# Altium schematic sheet L-Stick_sheet4_leds.SchDoc: L-Stick - LED Lights
size A4; DocumentNumber: 4; Revision: 1.0.0; SheetNumber: 4; SheetTotal: 5; DrawnBy: SU; DocumentSize: A4; PCAName: L-Stick
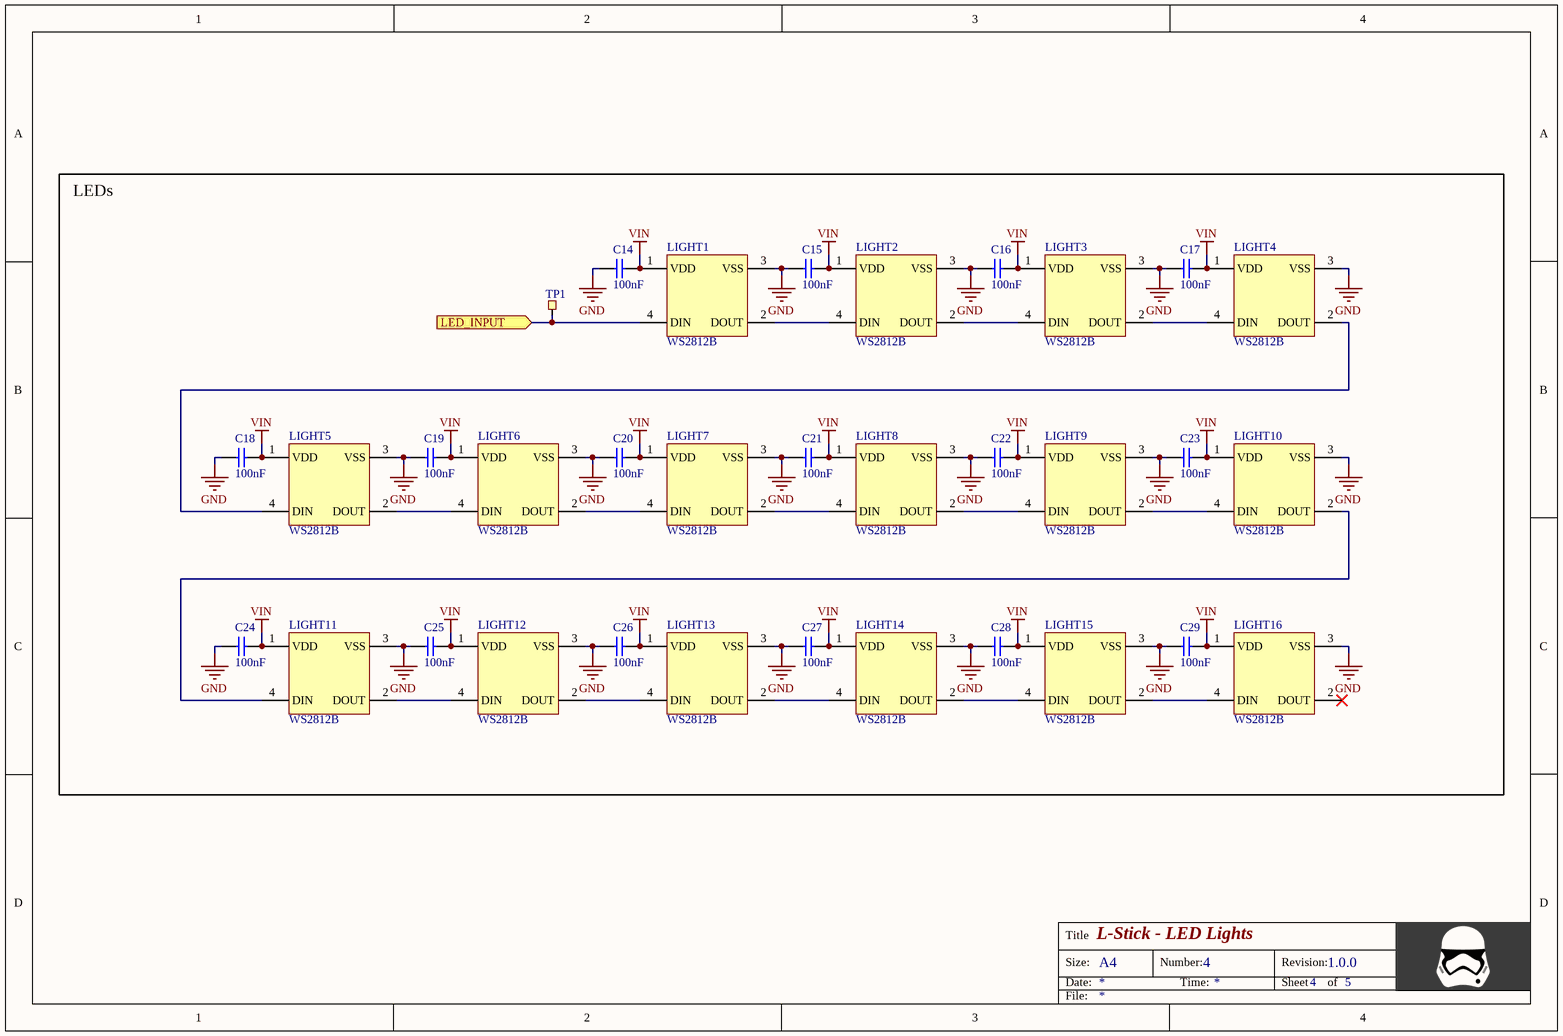
[diagram p0: L-Stick_sheet4_leds.SchDoc]

## Parts
C14  100nF  [0402C]
C15  100nF  [0402C]
C16  100nF  [0402C]
C17  100nF  [0402C]
C18  100nF  [0402C]
C19  100nF  [0402C]
C20  100nF  [0402C]
C21  100nF  [0402C]
C22  100nF  [0402C]
C23  100nF  [0402C]
C24  100nF  [0402C]
C25  100nF  [0402C]
C26  100nF  [0402C]
C27  100nF  [0402C]
C28  100nF  [0402C]
C29  100nF  [0402C]
LIGHT1  WS2812B  [WS2812B]
LIGHT2  WS2812B  [WS2812B]
LIGHT3  WS2812B  [WS2812B]
LIGHT4  WS2812B  [WS2812B]
LIGHT5  WS2812B  [WS2812B]
LIGHT6  WS2812B  [WS2812B]
LIGHT7  WS2812B  [WS2812B]
LIGHT8  WS2812B  [WS2812B]
LIGHT9  WS2812B  [WS2812B]
LIGHT10  WS2812B  [WS2812B]
LIGHT11  WS2812B  [WS2812B]
LIGHT12  WS2812B  [WS2812B]
LIGHT13  WS2812B  [WS2812B]
LIGHT14  WS2812B  [WS2812B]
LIGHT15  WS2812B  [WS2812B]
LIGHT16  WS2812B  [WS2812B]
TP1  Ø1.5mm,SMD  [TP_SMD]  (value not drawn)  (no BOM)

## Blocks framed on the sheet
LEDs: C14-C29 LIGHT1-LIGHT16 TP1

## Ports
LED_INPUT (in)

## Nets
GND: C14.1 C15.1 C16.1 C17.1 C18.1 C19.1 C20.1 C21.1 C22.1 C23.1 C24.1 C25.1 C26.1 C27.1 C28.1 C29.1 LIGHT1.3(VSS) LIGHT2.3(VSS) LIGHT3.3(VSS) LIGHT4.3(VSS) LIGHT5.3(VSS) LIGHT6.3(VSS) LIGHT7.3(VSS) LIGHT8.3(VSS) LIGHT9.3(VSS) LIGHT10.3(VSS) LIGHT11.3(VSS) LIGHT12.3(VSS) LIGHT13.3(VSS) LIGHT14.3(VSS) LIGHT15.3(VSS) LIGHT16.3(VSS)
VIN: C14.2 C15.2 C16.2 C17.2 C18.2 C19.2 C20.2 C21.2 C22.2 C23.2 C24.2 C25.2 C26.2 C27.2 C28.2 C29.2 LIGHT1.1(VDD) LIGHT2.1(VDD) LIGHT3.1(VDD) LIGHT4.1(VDD) LIGHT5.1(VDD) LIGHT6.1(VDD) LIGHT7.1(VDD) LIGHT8.1(VDD) LIGHT9.1(VDD) LIGHT10.1(VDD) LIGHT11.1(VDD) LIGHT12.1(VDD) LIGHT13.1(VDD) LIGHT14.1(VDD) LIGHT15.1(VDD) LIGHT16.1(VDD)
LED_INPUT: LIGHT1.4(DIN) TP1.1 ; port LED_INPUT
NetLIGHT1_2: LIGHT1.2(DOUT) LIGHT2.4(DIN)
NetLIGHT2_2: LIGHT2.2(DOUT) LIGHT3.4(DIN)
NetLIGHT3_2: LIGHT3.2(DOUT) LIGHT4.4(DIN)
NetLIGHT4_2: LIGHT4.2(DOUT) LIGHT5.4(DIN)
NetLIGHT5_2: LIGHT5.2(DOUT) LIGHT6.4(DIN)
NetLIGHT6_2: LIGHT6.2(DOUT) LIGHT7.4(DIN)
NetLIGHT7_2: LIGHT7.2(DOUT) LIGHT8.4(DIN)
NetLIGHT8_2: LIGHT8.2(DOUT) LIGHT9.4(DIN)
NetLIGHT9_2: LIGHT9.2(DOUT) LIGHT10.4(DIN)
NetLIGHT10_2: LIGHT10.2(DOUT) LIGHT11.4(DIN)
NetLIGHT11_2: LIGHT11.2(DOUT) LIGHT12.4(DIN)
NetLIGHT12_2: LIGHT12.2(DOUT) LIGHT13.4(DIN)
NetLIGHT13_2: LIGHT13.2(DOUT) LIGHT14.4(DIN)
NetLIGHT14_2: LIGHT14.2(DOUT) LIGHT15.4(DIN)
NetLIGHT15_2: LIGHT15.2(DOUT) LIGHT16.4(DIN)

Not connected (* = marked no-connect by the designer): LIGHT16 2(DOUT)*

## Notes on the sheet
- Title
- Size:
- Date:
- A4
- Number:
- Time:
- Revision:
- Sheet
- of
- File:

## Library data of the parts
C14-C29 = CAP_0402: Capacitor; Value: 100nF
LIGHT1-LIGHT16 = WS2812B: Integrated RGB LED; Value: WS2812B
TP1 = TP_SMD_Ø1.0MM: 1.0mm circular SMD testpad; Value: Ø1.5mm,SMD